# Altium schematic sheet Ultrasonic Sensor.SchDoc
size A
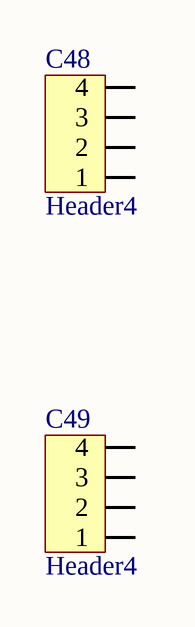
[diagram p0: Ultrasonic Sensor.SchDoc]

## Parts
C48  Header4  [HDR4]
C49  Header4  [HDR4]

## Nets

Not connected (* = marked no-connect by the designer): C48 1 2 3 4; C49 1 2 3 4

## Library data of the parts
C48 C49 = Header4: Header IDC, 4 x 1 Pin Vertical 2.54mm Pitch (Non-Boxed, Male); Manufacturer: W¨¹rth Elektronik eiSos GmbH; partNo: 613002143121; ComponentLink1 Description: Manufacturer; ComponentLink2 Description: Datasheet; NoPins: 02; Created Date: 29 March 2013; ComponentLink1URL: http://www.we-online.com; ComponentLink2URL: http://katalog.we-online.de/em/datasheet/6130xx143121.pdf; Created by: Karrer Zheng